# EAGLE design Tacho Update Platine mehrfach (EAGLE 6.4)

## Sheet 1 of 16
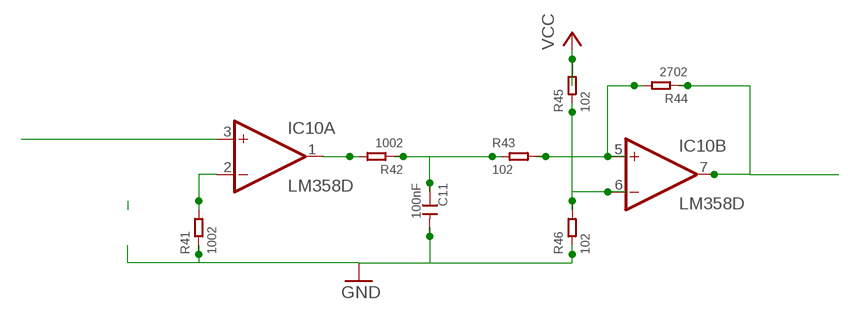
[diagram p0: schematic, sheet 1]

### Parts
C11  100nF  CERAMIC-100NF-50V-10%-X7R(0805)  [C0805]
IC10  LM358D  [SO08]
R41  1002  SMD-RES-10K-1%-1/8W(0805)  [R0805]
R42  1002  SMD-RES-10K-1%-1/8W(0805)  [R0805]
R43  102  SMD-RES-1K-5%-1/8W(0805)  [R0805]
R44  2702  SMD-RES-4.7K-5%-1/8W(0805)  [R0805]
R45  102  SMD-RES-1K-5%-1/8W(0805)  [R0805]
R46  102  SMD-RES-1K-5%-1/8W(0805)  [R0805]

### Nets
GND: C11.2 R41.1 R46.1 ; also sheet 2,3,4,5,6,7,8,9,10,11,12,13,14,15,16
N$24: IC10.3(A:+IN)
N$92: IC10.1(A:OUT) R42.2
N$96: C11.1 R42.1 R43.1
N$97: IC10.5(B:+IN) R43.2 R44.2
N$101: IC10.6(B:-IN) R45.1 R46.2
N$102: IC10.2(A:-IN) R41.2
N$174: IC10.7(B:OUT) R44.1
VCC: R45.2 ; also sheet 2,3,4,5,6,7,8,9,10,11,12,13,14,15,16

## Sheet 2 of 16
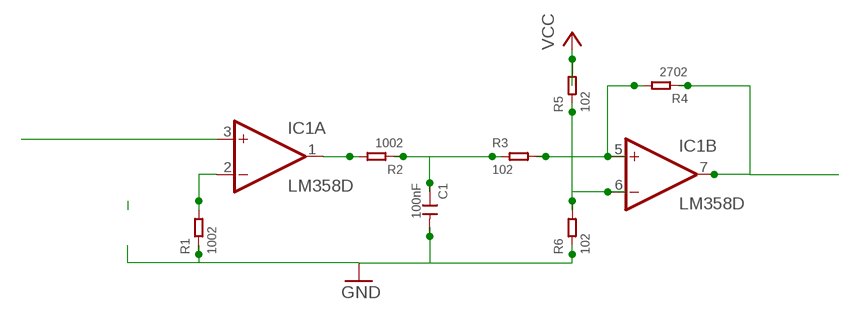
[diagram p1: schematic, sheet 2]

### Parts
C1  100nF  CERAMIC-100NF-50V-10%-X7R(0805)  [C0805]
IC1  LM358D  [SO08]
R1  1002  SMD-RES-10K-1%-1/8W(0805)  [R0805]
R2  1002  SMD-RES-10K-1%-1/8W(0805)  [R0805]
R3  102  SMD-RES-1K-5%-1/8W(0805)  [R0805]
R4  2702  SMD-RES-4.7K-5%-1/8W(0805)  [R0805]
R5  102  SMD-RES-1K-5%-1/8W(0805)  [R0805]
R6  102  SMD-RES-1K-5%-1/8W(0805)  [R0805]

### Nets
GND: C1.2 R1.1 R6.1 ; also sheet 1,3,4,5,6,7,8,9,10,11,12,13,14,15,16
N$7: IC1.3(A:+IN)
N$8: IC1.1(A:OUT) R2.2
N$9: C1.1 R2.1 R3.1
N$11: IC1.5(B:+IN) R3.2 R4.2
N$12: IC1.6(B:-IN) R5.1 R6.2
N$13: IC1.2(A:-IN) R1.2
N$15: IC1.7(B:OUT) R4.1
VCC: R5.2 ; also sheet 1,3,4,5,6,7,8,9,10,11,12,13,14,15,16

## Sheet 3 of 16
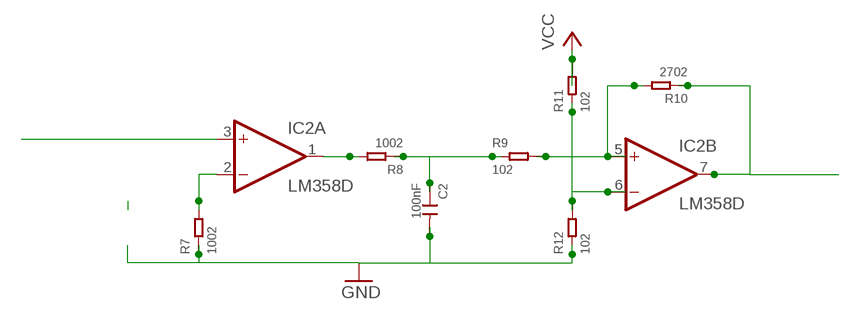
[diagram p2: schematic, sheet 3]

### Parts
C2  100nF  CERAMIC-100NF-50V-10%-X7R(0805)  [C0805]
IC2  LM358D  [SO08]
R7  1002  SMD-RES-10K-1%-1/8W(0805)  [R0805]
R8  1002  SMD-RES-10K-1%-1/8W(0805)  [R0805]
R9  102  SMD-RES-1K-5%-1/8W(0805)  [R0805]
R10  2702  SMD-RES-4.7K-5%-1/8W(0805)  [R0805]
R11  102  SMD-RES-1K-5%-1/8W(0805)  [R0805]
R12  102  SMD-RES-1K-5%-1/8W(0805)  [R0805]

### Nets
GND: C2.2 R7.1 R12.1 ; also sheet 1,2,4,5,6,7,8,9,10,11,12,13,14,15,16
N$30: IC2.3(A:+IN)
N$31: IC2.1(A:OUT) R8.2
N$32: C2.1 R8.1 R9.1
N$33: IC2.5(B:+IN) R9.2 R10.2
N$34: IC2.6(B:-IN) R11.1 R12.2
N$35: IC2.2(A:-IN) R7.2
N$37: IC2.7(B:OUT) R10.1
VCC: R11.2 ; also sheet 1,2,4,5,6,7,8,9,10,11,12,13,14,15,16

## Sheet 4 of 16
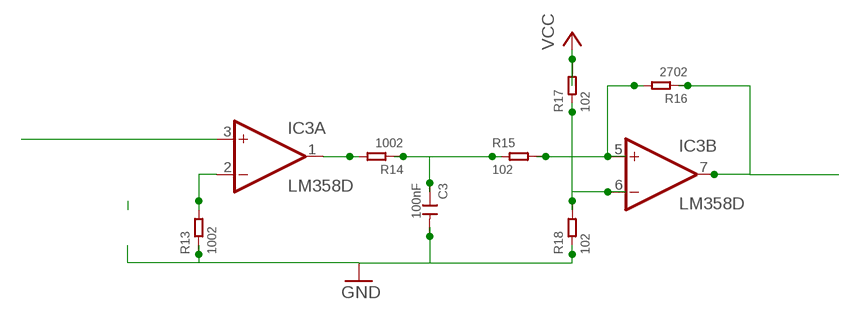
[diagram p3: schematic, sheet 4]

### Parts
C3  100nF  CERAMIC-100NF-50V-10%-X7R(0805)  [C0805]
IC3  LM358D  [SO08]
R13  1002  SMD-RES-10K-1%-1/8W(0805)  [R0805]
R14  1002  SMD-RES-10K-1%-1/8W(0805)  [R0805]
R15  102  SMD-RES-1K-5%-1/8W(0805)  [R0805]
R16  2702  SMD-RES-4.7K-5%-1/8W(0805)  [R0805]
R17  102  SMD-RES-1K-5%-1/8W(0805)  [R0805]
R18  102  SMD-RES-1K-5%-1/8W(0805)  [R0805]

### Nets
GND: C3.2 R13.1 R18.1 ; also sheet 1,2,3,5,6,7,8,9,10,11,12,13,14,15,16
N$38: IC3.3(A:+IN)
N$39: IC3.1(A:OUT) R14.2
N$41: C3.1 R14.1 R15.1
N$42: IC3.5(B:+IN) R15.2 R16.2
N$43: IC3.6(B:-IN) R17.1 R18.2
N$44: IC3.2(A:-IN) R13.2
N$46: IC3.7(B:OUT) R16.1
VCC: R17.2 ; also sheet 1,2,3,5,6,7,8,9,10,11,12,13,14,15,16

## Sheet 5 of 16
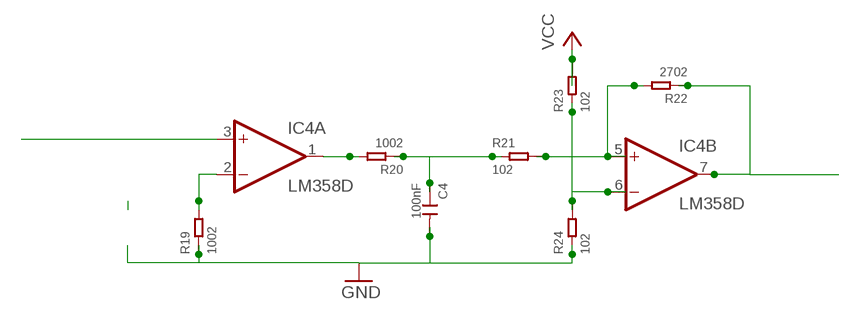
[diagram p4: schematic, sheet 5]

### Parts
C4  100nF  CERAMIC-100NF-50V-10%-X7R(0805)  [C0805]
IC4  LM358D  [SO08]
R19  1002  SMD-RES-10K-1%-1/8W(0805)  [R0805]
R20  1002  SMD-RES-10K-1%-1/8W(0805)  [R0805]
R21  102  SMD-RES-1K-5%-1/8W(0805)  [R0805]
R22  2702  SMD-RES-4.7K-5%-1/8W(0805)  [R0805]
R23  102  SMD-RES-1K-5%-1/8W(0805)  [R0805]
R24  102  SMD-RES-1K-5%-1/8W(0805)  [R0805]

### Nets
GND: C4.2 R19.1 R24.1 ; also sheet 1,2,3,4,6,7,8,9,10,11,12,13,14,15,16
N$78: IC4.3(A:+IN)
N$79: IC4.1(A:OUT) R20.2
N$80: C4.1 R20.1 R21.1
N$81: IC4.5(B:+IN) R21.2 R22.2
N$82: IC4.6(B:-IN) R23.1 R24.2
N$83: IC4.2(A:-IN) R19.2
N$85: IC4.7(B:OUT) R22.1
VCC: R23.2 ; also sheet 1,2,3,4,6,7,8,9,10,11,12,13,14,15,16

## Sheet 6 of 16
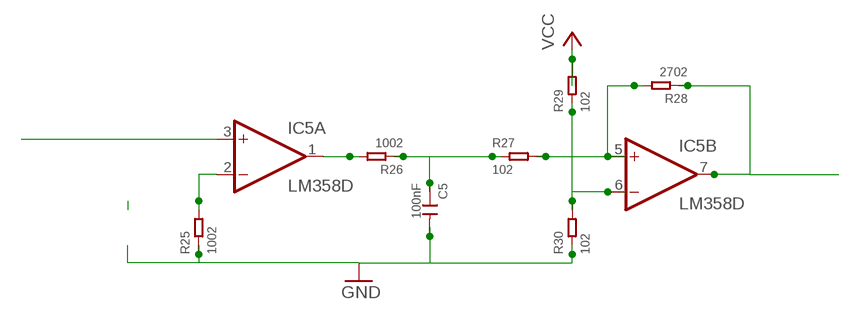
[diagram p5: schematic, sheet 6]

### Parts
C5  100nF  CERAMIC-100NF-50V-10%-X7R(0805)  [C0805]
IC5  LM358D  [SO08]
R25  1002  SMD-RES-10K-1%-1/8W(0805)  [R0805]
R26  1002  SMD-RES-10K-1%-1/8W(0805)  [R0805]
R27  102  SMD-RES-1K-5%-1/8W(0805)  [R0805]
R28  2702  SMD-RES-4.7K-5%-1/8W(0805)  [R0805]
R29  102  SMD-RES-1K-5%-1/8W(0805)  [R0805]
R30  102  SMD-RES-1K-5%-1/8W(0805)  [R0805]

### Nets
GND: C5.2 R25.1 R30.1 ; also sheet 1,2,3,4,5,7,8,9,10,11,12,13,14,15,16
N$86: IC5.3(A:+IN)
N$87: IC5.1(A:OUT) R26.2
N$88: C5.1 R26.1 R27.1
N$89: IC5.5(B:+IN) R27.2 R28.2
N$90: IC5.6(B:-IN) R29.1 R30.2
N$91: IC5.2(A:-IN) R25.2
N$94: IC5.7(B:OUT) R28.1
VCC: R29.2 ; also sheet 1,2,3,4,5,7,8,9,10,11,12,13,14,15,16

## Sheet 7 of 16
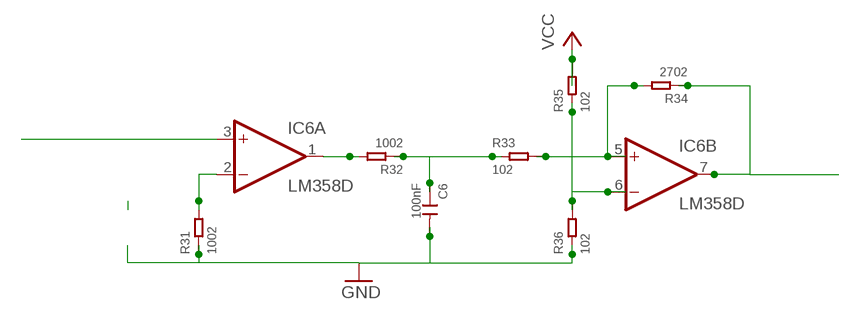
[diagram p6: schematic, sheet 7]

### Parts
C6  100nF  CERAMIC-100NF-50V-10%-X7R(0805)  [C0805]
IC6  LM358D  [SO08]
R31  1002  SMD-RES-10K-1%-1/8W(0805)  [R0805]
R32  1002  SMD-RES-10K-1%-1/8W(0805)  [R0805]
R33  102  SMD-RES-1K-5%-1/8W(0805)  [R0805]
R34  2702  SMD-RES-4.7K-5%-1/8W(0805)  [R0805]
R35  102  SMD-RES-1K-5%-1/8W(0805)  [R0805]
R36  102  SMD-RES-1K-5%-1/8W(0805)  [R0805]

### Nets
GND: C6.2 R31.1 R36.1 ; also sheet 1,2,3,4,5,6,8,9,10,11,12,13,14,15,16
N$95: IC6.3(A:+IN)
N$99: IC6.1(A:OUT) R32.2
N$100: C6.1 R32.1 R33.1
N$103: IC6.5(B:+IN) R33.2 R34.2
N$104: IC6.6(B:-IN) R35.1 R36.2
N$105: IC6.2(A:-IN) R31.2
N$107: IC6.7(B:OUT) R34.1
VCC: R35.2 ; also sheet 1,2,3,4,5,6,8,9,10,11,12,13,14,15,16

## Sheet 8 of 16
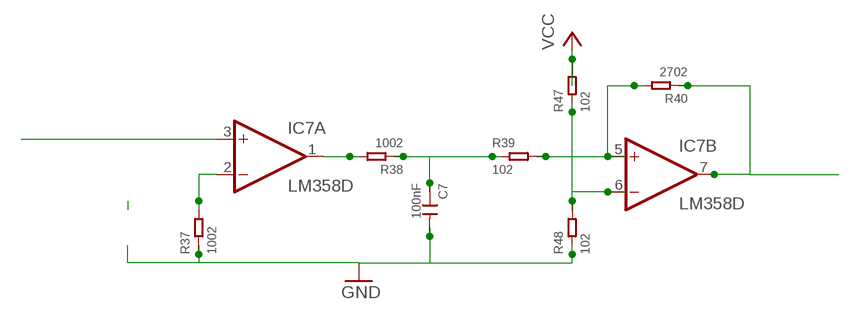
[diagram p7: schematic, sheet 8]

### Parts
C7  100nF  CERAMIC-100NF-50V-10%-X7R(0805)  [C0805]
IC7  LM358D  [SO08]
R37  1002  SMD-RES-10K-1%-1/8W(0805)  [R0805]
R38  1002  SMD-RES-10K-1%-1/8W(0805)  [R0805]
R39  102  SMD-RES-1K-5%-1/8W(0805)  [R0805]
R40  2702  SMD-RES-4.7K-5%-1/8W(0805)  [R0805]
R47  102  SMD-RES-1K-5%-1/8W(0805)  [R0805]
R48  102  SMD-RES-1K-5%-1/8W(0805)  [R0805]

### Nets
GND: C7.2 R37.1 R48.1 ; also sheet 1,2,3,4,5,6,7,9,10,11,12,13,14,15,16
N$108: IC7.3(A:+IN)
N$109: IC7.1(A:OUT) R38.2
N$110: C7.1 R38.1 R39.1
N$111: IC7.5(B:+IN) R39.2 R40.2
N$112: IC7.6(B:-IN) R47.1 R48.2
N$113: IC7.2(A:-IN) R37.2
N$115: IC7.7(B:OUT) R40.1
VCC: R47.2 ; also sheet 1,2,3,4,5,6,7,9,10,11,12,13,14,15,16

## Sheet 9 of 16
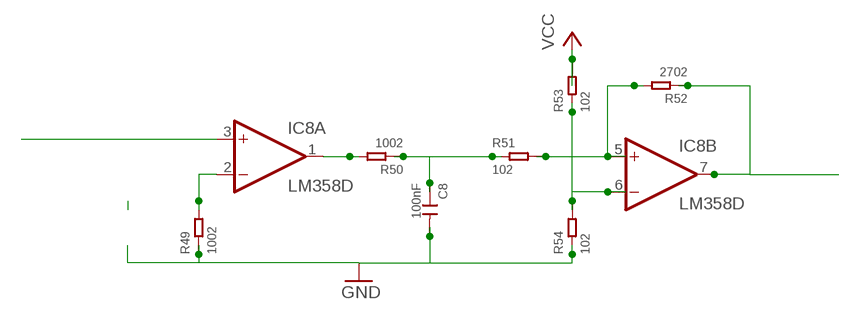
[diagram p8: schematic, sheet 9]

### Parts
C8  100nF  CERAMIC-100NF-50V-10%-X7R(0805)  [C0805]
IC8  LM358D  [SO08]
R49  1002  SMD-RES-10K-1%-1/8W(0805)  [R0805]
R50  1002  SMD-RES-10K-1%-1/8W(0805)  [R0805]
R51  102  SMD-RES-1K-5%-1/8W(0805)  [R0805]
R52  2702  SMD-RES-4.7K-5%-1/8W(0805)  [R0805]
R53  102  SMD-RES-1K-5%-1/8W(0805)  [R0805]
R54  102  SMD-RES-1K-5%-1/8W(0805)  [R0805]

### Nets
GND: C8.2 R49.1 R54.1 ; also sheet 1,2,3,4,5,6,7,8,10,11,12,13,14,15,16
N$168: IC8.3(A:+IN)
N$169: IC8.1(A:OUT) R50.2
N$170: C8.1 R50.1 R51.1
N$171: IC8.5(B:+IN) R51.2 R52.2
N$172: IC8.6(B:-IN) R53.1 R54.2
N$173: IC8.2(A:-IN) R49.2
N$176: IC8.7(B:OUT) R52.1
VCC: R53.2 ; also sheet 1,2,3,4,5,6,7,8,10,11,12,13,14,15,16

## Sheet 10 of 16
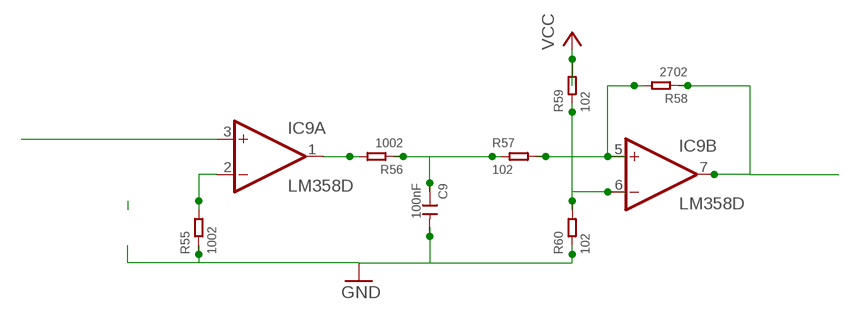
[diagram p9: schematic, sheet 10]

### Parts
C9  100nF  CERAMIC-100NF-50V-10%-X7R(0805)  [C0805]
IC9  LM358D  [SO08]
R55  1002  SMD-RES-10K-1%-1/8W(0805)  [R0805]
R56  1002  SMD-RES-10K-1%-1/8W(0805)  [R0805]
R57  102  SMD-RES-1K-5%-1/8W(0805)  [R0805]
R58  2702  SMD-RES-4.7K-5%-1/8W(0805)  [R0805]
R59  102  SMD-RES-1K-5%-1/8W(0805)  [R0805]
R60  102  SMD-RES-1K-5%-1/8W(0805)  [R0805]

### Nets
GND: C9.2 R55.1 R60.1 ; also sheet 1,2,3,4,5,6,7,8,9,11,12,13,14,15,16
N$177: IC9.3(A:+IN)
N$178: IC9.1(A:OUT) R56.2
N$179: C9.1 R56.1 R57.1
N$180: IC9.5(B:+IN) R57.2 R58.2
N$181: IC9.6(B:-IN) R59.1 R60.2
N$182: IC9.2(A:-IN) R55.2
N$184: IC9.7(B:OUT) R58.1
VCC: R59.2 ; also sheet 1,2,3,4,5,6,7,8,9,11,12,13,14,15,16

## Sheet 11 of 16
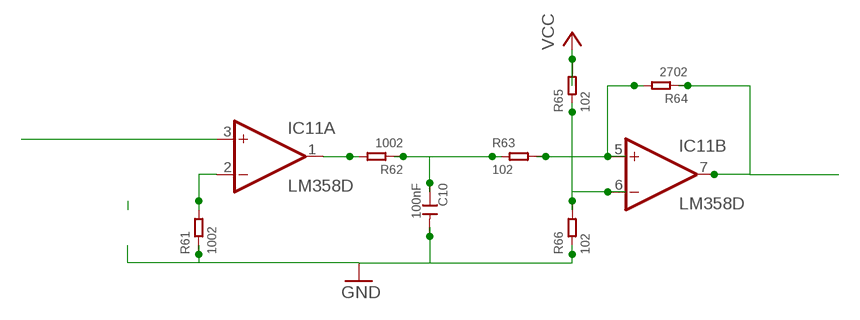
[diagram p10: schematic, sheet 11]

### Parts
C10  100nF  CERAMIC-100NF-50V-10%-X7R(0805)  [C0805]
IC11  LM358D  [SO08]
R61  1002  SMD-RES-10K-1%-1/8W(0805)  [R0805]
R62  1002  SMD-RES-10K-1%-1/8W(0805)  [R0805]
R63  102  SMD-RES-1K-5%-1/8W(0805)  [R0805]
R64  2702  SMD-RES-4.7K-5%-1/8W(0805)  [R0805]
R65  102  SMD-RES-1K-5%-1/8W(0805)  [R0805]
R66  102  SMD-RES-1K-5%-1/8W(0805)  [R0805]

### Nets
GND: C10.2 R61.1 R66.1 ; also sheet 1,2,3,4,5,6,7,8,9,10,12,13,14,15,16
N$185: IC11.3(A:+IN)
N$186: IC11.1(A:OUT) R62.2
N$187: C10.1 R62.1 R63.1
N$188: IC11.5(B:+IN) R63.2 R64.2
N$189: IC11.6(B:-IN) R65.1 R66.2
N$190: IC11.2(A:-IN) R61.2
N$192: IC11.7(B:OUT) R64.1
VCC: R65.2 ; also sheet 1,2,3,4,5,6,7,8,9,10,12,13,14,15,16

## Sheet 12 of 16
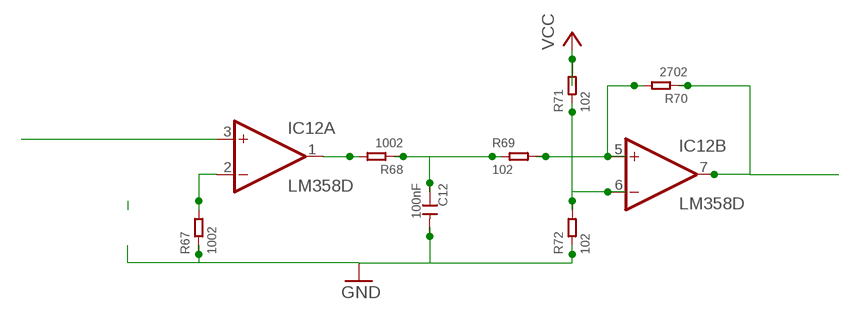
[diagram p11: schematic, sheet 12]

### Parts
C12  100nF  CERAMIC-100NF-50V-10%-X7R(0805)  [C0805]
IC12  LM358D  [SO08]
R67  1002  SMD-RES-10K-1%-1/8W(0805)  [R0805]
R68  1002  SMD-RES-10K-1%-1/8W(0805)  [R0805]
R69  102  SMD-RES-1K-5%-1/8W(0805)  [R0805]
R70  2702  SMD-RES-4.7K-5%-1/8W(0805)  [R0805]
R71  102  SMD-RES-1K-5%-1/8W(0805)  [R0805]
R72  102  SMD-RES-1K-5%-1/8W(0805)  [R0805]

### Nets
GND: C12.2 R67.1 R72.1 ; also sheet 1,2,3,4,5,6,7,8,9,10,11,13,14,15,16
N$193: IC12.3(A:+IN)
N$194: IC12.1(A:OUT) R68.2
N$195: C12.1 R68.1 R69.1
N$196: IC12.5(B:+IN) R69.2 R70.2
N$197: IC12.6(B:-IN) R71.1 R72.2
N$198: IC12.2(A:-IN) R67.2
N$200: IC12.7(B:OUT) R70.1
VCC: R71.2 ; also sheet 1,2,3,4,5,6,7,8,9,10,11,13,14,15,16

## Sheet 13 of 16
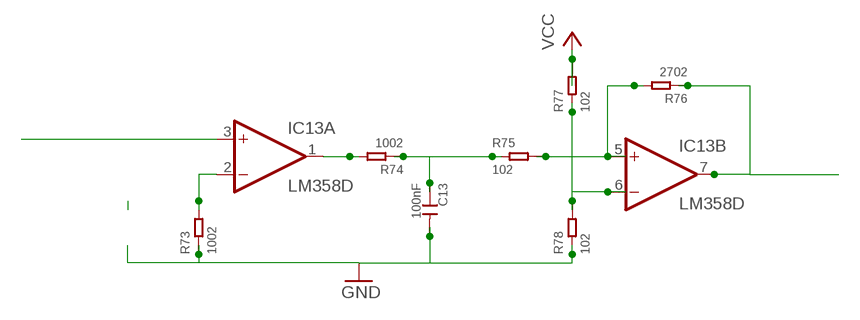
[diagram p12: schematic, sheet 13]

### Parts
C13  100nF  CERAMIC-100NF-50V-10%-X7R(0805)  [C0805]
IC13  LM358D  [SO08]
R73  1002  SMD-RES-10K-1%-1/8W(0805)  [R0805]
R74  1002  SMD-RES-10K-1%-1/8W(0805)  [R0805]
R75  102  SMD-RES-1K-5%-1/8W(0805)  [R0805]
R76  2702  SMD-RES-4.7K-5%-1/8W(0805)  [R0805]
R77  102  SMD-RES-1K-5%-1/8W(0805)  [R0805]
R78  102  SMD-RES-1K-5%-1/8W(0805)  [R0805]

### Nets
GND: C13.2 R73.1 R78.1 ; also sheet 1,2,3,4,5,6,7,8,9,10,11,12,14,15,16
N$201: IC13.3(A:+IN)
N$202: IC13.1(A:OUT) R74.2
N$203: C13.1 R74.1 R75.1
N$204: IC13.5(B:+IN) R75.2 R76.2
N$205: IC13.6(B:-IN) R77.1 R78.2
N$206: IC13.2(A:-IN) R73.2
N$208: IC13.7(B:OUT) R76.1
VCC: R77.2 ; also sheet 1,2,3,4,5,6,7,8,9,10,11,12,14,15,16

## Sheet 14 of 16
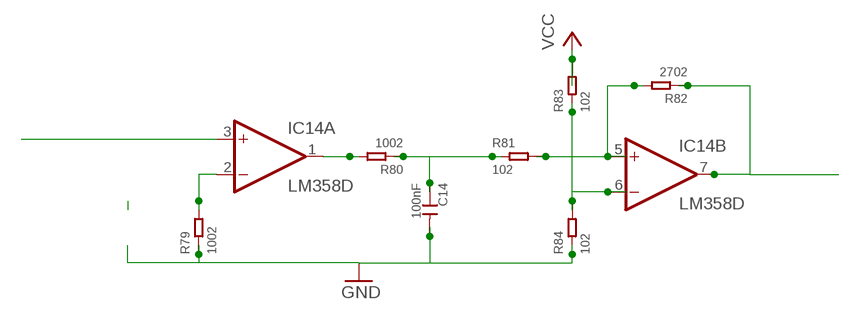
[diagram p13: schematic, sheet 14]

### Parts
C14  100nF  CERAMIC-100NF-50V-10%-X7R(0805)  [C0805]
IC14  LM358D  [SO08]
R79  1002  SMD-RES-10K-1%-1/8W(0805)  [R0805]
R80  1002  SMD-RES-10K-1%-1/8W(0805)  [R0805]
R81  102  SMD-RES-1K-5%-1/8W(0805)  [R0805]
R82  2702  SMD-RES-4.7K-5%-1/8W(0805)  [R0805]
R83  102  SMD-RES-1K-5%-1/8W(0805)  [R0805]
R84  102  SMD-RES-1K-5%-1/8W(0805)  [R0805]

### Nets
GND: C14.2 R79.1 R84.1 ; also sheet 1,2,3,4,5,6,7,8,9,10,11,12,13,15,16
N$209: IC14.3(A:+IN)
N$210: IC14.1(A:OUT) R80.2
N$211: C14.1 R80.1 R81.1
N$212: IC14.5(B:+IN) R81.2 R82.2
N$213: IC14.6(B:-IN) R83.1 R84.2
N$214: IC14.2(A:-IN) R79.2
N$216: IC14.7(B:OUT) R82.1
VCC: R83.2 ; also sheet 1,2,3,4,5,6,7,8,9,10,11,12,13,15,16

## Sheet 15 of 16
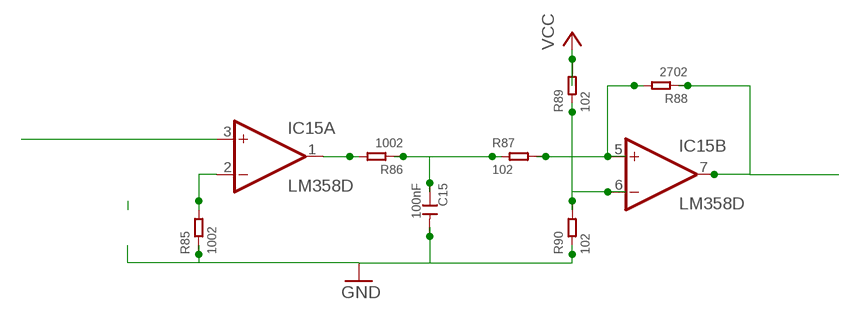
[diagram p14: schematic, sheet 15]

### Parts
C15  100nF  CERAMIC-100NF-50V-10%-X7R(0805)  [C0805]
IC15  LM358D  [SO08]
R85  1002  SMD-RES-10K-1%-1/8W(0805)  [R0805]
R86  1002  SMD-RES-10K-1%-1/8W(0805)  [R0805]
R87  102  SMD-RES-1K-5%-1/8W(0805)  [R0805]
R88  2702  SMD-RES-4.7K-5%-1/8W(0805)  [R0805]
R89  102  SMD-RES-1K-5%-1/8W(0805)  [R0805]
R90  102  SMD-RES-1K-5%-1/8W(0805)  [R0805]

### Nets
GND: C15.2 R85.1 R90.1 ; also sheet 1,2,3,4,5,6,7,8,9,10,11,12,13,14,16
N$217: IC15.3(A:+IN)
N$218: IC15.1(A:OUT) R86.2
N$219: C15.1 R86.1 R87.1
N$220: IC15.5(B:+IN) R87.2 R88.2
N$221: IC15.6(B:-IN) R89.1 R90.2
N$222: IC15.2(A:-IN) R85.2
N$224: IC15.7(B:OUT) R88.1
VCC: R89.2 ; also sheet 1,2,3,4,5,6,7,8,9,10,11,12,13,14,16

## Sheet 16 of 16
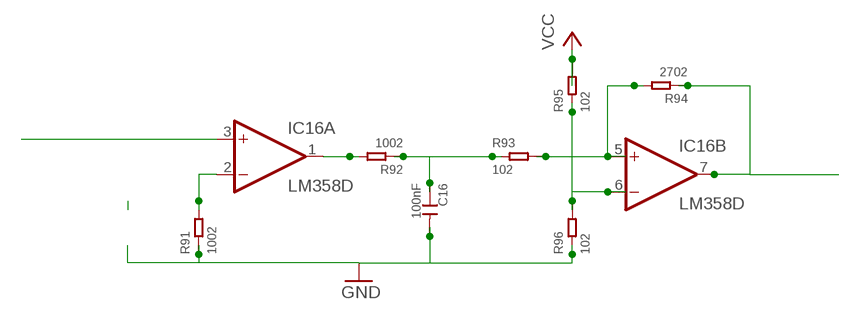
[diagram p15: schematic, sheet 16]

### Parts
C16  100nF  CERAMIC-100NF-50V-10%-X7R(0805)  [C0805]
IC16  LM358D  [SO08]
R91  1002  SMD-RES-10K-1%-1/8W(0805)  [R0805]
R92  1002  SMD-RES-10K-1%-1/8W(0805)  [R0805]
R93  102  SMD-RES-1K-5%-1/8W(0805)  [R0805]
R94  2702  SMD-RES-4.7K-5%-1/8W(0805)  [R0805]
R95  102  SMD-RES-1K-5%-1/8W(0805)  [R0805]
R96  102  SMD-RES-1K-5%-1/8W(0805)  [R0805]

### Nets
GND: C16.2 R91.1 R96.1 ; also sheet 1,2,3,4,5,6,7,8,9,10,11,12,13,14,15
N$225: IC16.3(A:+IN)
N$226: IC16.1(A:OUT) R92.2
N$227: C16.1 R92.1 R93.1
N$228: IC16.5(B:+IN) R93.2 R94.2
N$229: IC16.6(B:-IN) R95.1 R96.2
N$230: IC16.2(A:-IN) R91.2
N$232: IC16.7(B:OUT) R94.1
VCC: R95.2 ; also sheet 1,2,3,4,5,6,7,8,9,10,11,12,13,14,15

## Power pins joined to a net without a drawn wire
V+: IC10.8(P:V+)
V+1: IC1.8(P:V+)
V+2: IC2.8(P:V+)
V+3: IC3.8(P:V+)
V+4: IC4.8(P:V+)
V+5: IC5.8(P:V+)
V+6: IC6.8(P:V+)
V+7: IC7.8(P:V+)
V+8: IC8.8(P:V+)
V+9: IC9.8(P:V+)
V+10: IC11.8(P:V+)
V+11: IC12.8(P:V+)
V+12: IC13.8(P:V+)
V+13: IC14.8(P:V+)
V+14: IC15.8(P:V+)
V+15: IC16.8(P:V+)
V-: IC10.4(P:V-)
V-1: IC1.4(P:V-)
V-2: IC2.4(P:V-)
V-3: IC3.4(P:V-)
V-4: IC4.4(P:V-)
V-5: IC5.4(P:V-)
V-6: IC6.4(P:V-)
V-7: IC7.4(P:V-)
V-8: IC8.4(P:V-)
V-9: IC9.4(P:V-)
V-10: IC11.4(P:V-)
V-11: IC12.4(P:V-)
V-12: IC13.4(P:V-)
V-13: IC14.4(P:V-)
V-14: IC15.4(P:V-)
V-15: IC16.4(P:V-)

## Library data of the parts
C1-C16 = Seeed-Capacitor-2016:CERAMIC-100NF-50V-10%-X7R(0805): 302010165; MPN: CC0805KRX7R9BB104; VALUE: 100nf
IC1-IC16 = linear_BMW:LM358: OP AMP also LM158; LM258; LM2904 Source: http://cache.national.com/ds/LM/LM158.pdf
R1 R2 R7 R8 R13 R14 R19 R20 R25 R26 R31 R32 R37 R38 R41 R42 R49 R50 R55 R56 R61 R62 R67 R68 R73 R74 R79 R80 R85 R86 R91 R92 = Seeed-Resistor-2016:SMD-RES-10K-1%-1/8W(0805): 301010361; MPN: RC0805FR-0710KL; VALUE: 10K
R3 R5 R6 R9 R11 R12 R15 R17 R18 R21 R23 R24 R27 R29 R30 R33 R35 R36 R39 R43 R45-R48 R51 R53 R54 R57 R59 R60 R63 R65 R66 R69 R71 R72 R75 R77 R78 R81 R83 R84 R87 R89 R90 R93 R95 R96 = Seeed-Resistor-2016:SMD-RES-1K-5%-1/8W(0805): 301010311; MPN: RC0805JR-071KL; VALUE: 1K
R4 R10 R16 R22 R28 R34 R40 R44 R52 R58 R64 R70 R76 R82 R88 R94 = Seeed-Resistor-2016:SMD-RES-4.7K-5%-1/8W(0805): 301010306; MPN: RC0805JR-074K7L; VALUE: 4.7K

## Board
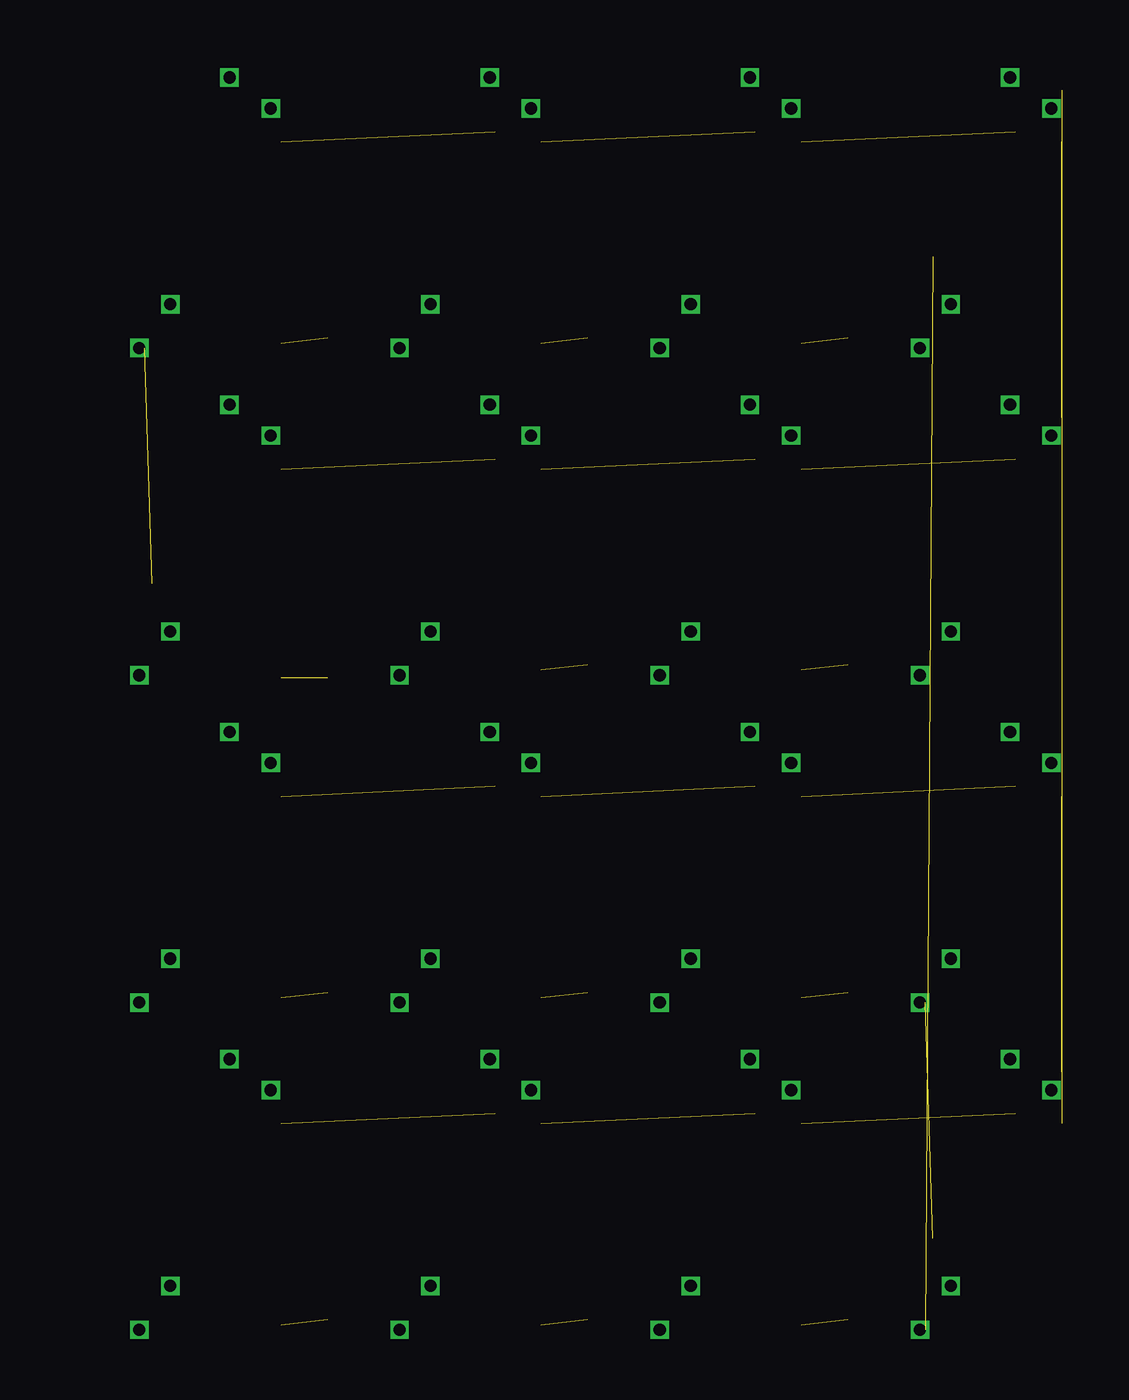
[diagram p16: board, top side]
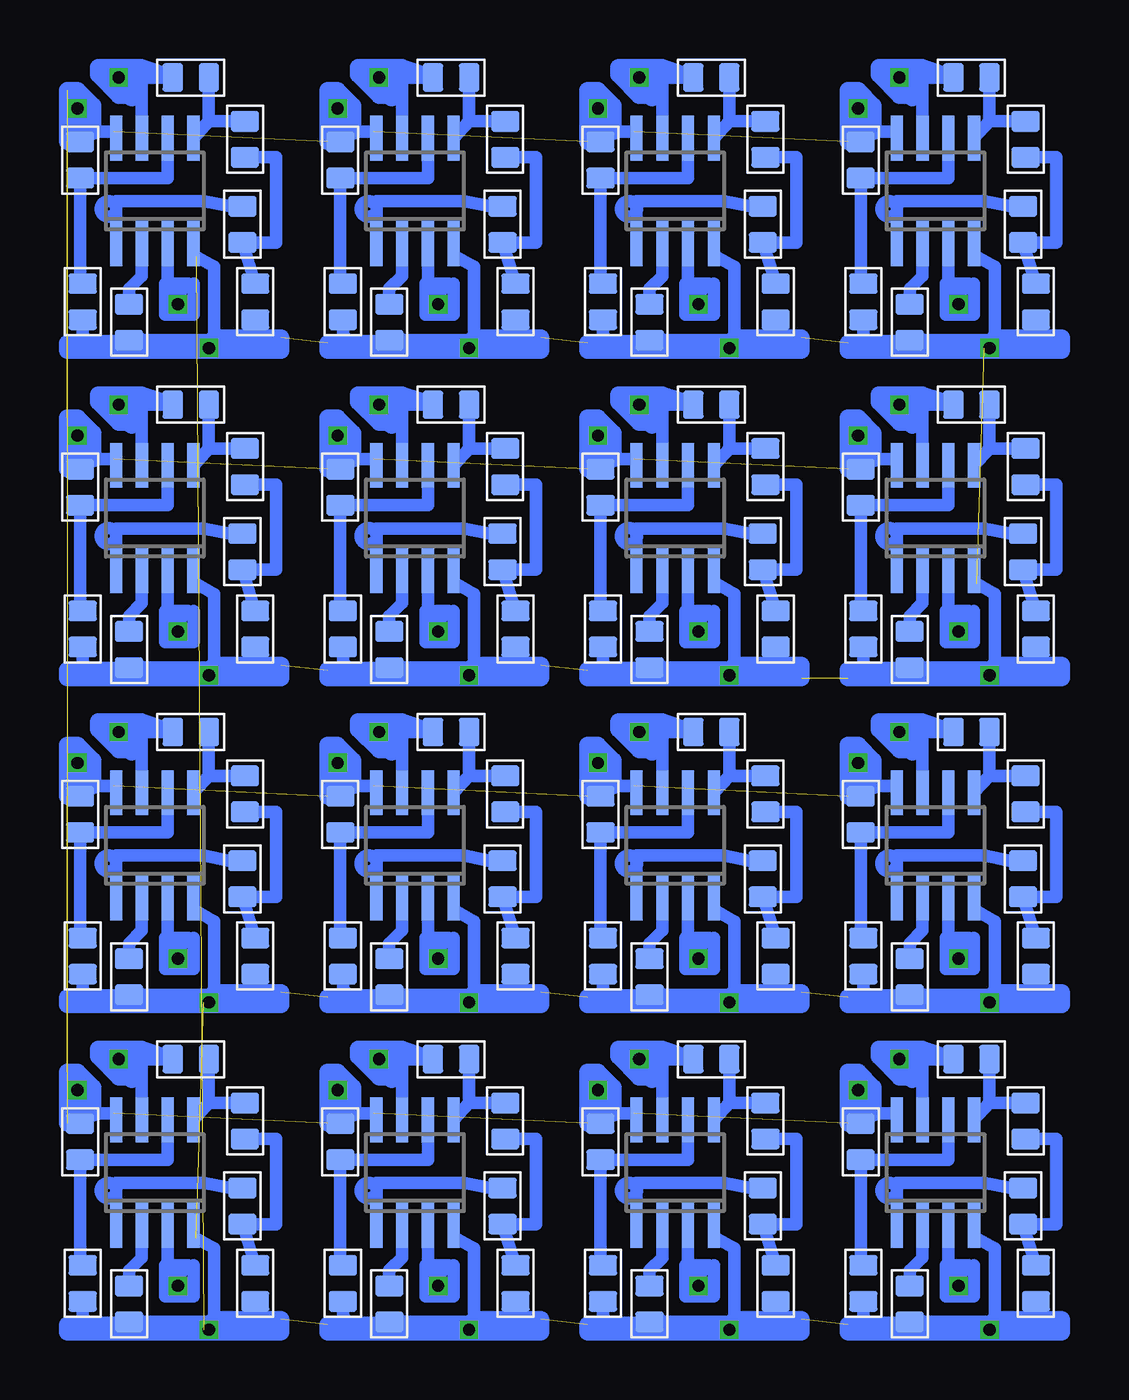
[diagram p17: board, bottom side, seen from below]

No outline drawn. Coordinates in mm, seen from the top.
Copper layers (1*16): Top 0.035mm / dielectric 1.5mm / Bottom 0.035mm
Design rules "multi-cb_035um-cu": minimum track width 6mil, minimum drill 12mil, track to track 6mil, track to pad 6mil, pad to pad 6mil, via to via 6mil, smd to smd 6mil, copper to edge 20mil, drill to drill 8mil, minimum pad ring 8mil, minimum via ring 6mil, stop-mask expansion 3mil, vias tented up to drill 0mil, thermal gap 8mil

### Footprints (pad centres in the part's own frame; a part is rotated, then mirrored left to right if it is on the bottom)
C0805 = smd 1.397 x 1.016: 1 0,0.889; 2 0,-0.889
SO08 = smd 0.6 x 2.2: 1 -1.905,-2.6; 2 -0.635,-2.6; 3 0.635,-2.6; 4 1.905,-2.6; 5 1.905,2.6; 6 0.635,2.6; 7 -0.635,2.6; 8 -1.905,2.6
R0805 = smd 1.397 x 1.016: 1 0,0.889; 2 0,-0.889

### Placement (x,y rotation side)
C1  15.49,3.56 0 bottom
C2  28.32,3.56 0 bottom
C3  41.15,3.56 0 bottom
C4  2.67,19.68 0 bottom
C5  15.49,19.68 0 bottom
C6  28.32,19.68 0 bottom
C7  41.15,19.68 0 bottom
C8  2.67,35.81 0 bottom
C9  15.49,35.81 0 bottom
C10  28.32,35.81 0 bottom
C11  2.67,3.56 0 bottom
C12  41.15,35.81 0 bottom
C13  2.67,51.94 0 bottom
C14  15.49,51.94 0 bottom
C15  28.32,51.94 0 bottom
C16  41.15,51.94 0 bottom
IC1  20.45,9.02 0 bottom
IC2  33.27,9.02 0 bottom
IC3  46.1,9.02 0 bottom
IC4  7.62,25.15 0 bottom
IC5  20.45,25.15 0 bottom
IC6  33.27,25.15 0 bottom
IC7  46.1,25.15 0 bottom
IC8  7.62,41.27 0 bottom
IC9  20.45,41.27 0 bottom
IC10  7.62,9.02 0 bottom
IC11  33.27,41.27 0 bottom
IC12  46.1,41.27 0 bottom
IC13  7.62,57.4 0 bottom
IC14  20.45,57.4 0 bottom
IC15  33.27,57.4 0 bottom
IC16  46.1,57.4 0 bottom
R1  21.72,2.54 180 bottom
R2  16.13,7.37 180 bottom
R3  16,11.56 180 bottom
R4  18.67,14.61 90 bottom
R5  24.13,10.54 180 bottom
R6  24,3.56 180 bottom
R7  34.54,2.54 180 bottom
R8  28.96,7.37 180 bottom
R9  28.83,11.56 180 bottom
R10  31.5,14.61 90 bottom
R11  36.96,10.54 180 bottom
R12  36.83,3.56 180 bottom
R13  47.37,2.54 180 bottom
R14  41.78,7.37 180 bottom
R15  41.66,11.56 180 bottom
R16  44.32,14.61 90 bottom
R17  49.78,10.54 180 bottom
R18  49.66,3.56 180 bottom
R19  8.89,18.67 180 bottom
R20  3.3,23.5 180 bottom
R21  3.17,27.69 180 bottom
R22  5.84,30.73 90 bottom
R23  11.3,26.67 180 bottom
R24  11.18,19.68 180 bottom
R25  21.72,18.67 180 bottom
R26  16.13,23.5 180 bottom
R27  16,27.69 180 bottom
R28  18.67,30.73 90 bottom
R29  24.13,26.67 180 bottom
R30  24,19.68 180 bottom
R31  34.54,18.67 180 bottom
R32  28.96,23.5 180 bottom
R33  28.83,27.69 180 bottom
R34  31.5,30.73 90 bottom
R35  36.96,26.67 180 bottom
R36  36.83,19.68 180 bottom
R37  47.37,18.67 180 bottom
R38  41.78,23.5 180 bottom
R39  41.66,27.69 180 bottom
R40  44.32,30.73 90 bottom
R41  8.89,2.54 180 bottom
R42  3.3,7.37 180 bottom
R43  3.17,11.56 180 bottom
R44  5.84,14.61 90 bottom
R45  11.3,10.54 180 bottom
R46  11.18,3.56 180 bottom
R47  49.78,26.67 180 bottom
R48  49.66,19.68 180 bottom
R49  8.89,34.8 180 bottom
R50  3.3,39.62 180 bottom
R51  3.17,43.81 180 bottom
R52  5.84,46.86 90 bottom
R53  11.3,42.8 180 bottom
R54  11.18,35.81 180 bottom
R55  21.72,34.8 180 bottom
R56  16.13,39.62 180 bottom
R57  16,43.81 180 bottom
R58  18.67,46.86 90 bottom
R59  24.13,42.8 180 bottom
R60  24,35.81 180 bottom
R61  34.54,34.8 180 bottom
R62  28.96,39.62 180 bottom
R63  28.83,43.81 180 bottom
R64  31.5,46.86 90 bottom
R65  36.96,42.8 180 bottom
R66  36.83,35.81 180 bottom
R67  47.37,34.8 180 bottom
R68  41.78,39.62 180 bottom
R69  41.66,43.81 180 bottom
R70  44.32,46.86 90 bottom
R71  49.78,42.8 180 bottom
R72  49.66,35.81 180 bottom
R73  8.89,50.93 180 bottom
R74  3.3,55.75 180 bottom
R75  3.17,59.94 180 bottom
R76  5.84,62.99 90 bottom
R77  11.3,58.93 180 bottom
R78  11.18,51.94 180 bottom
R79  21.72,50.93 180 bottom
R80  16.13,55.75 180 bottom
R81  16,59.94 180 bottom
R82  18.67,62.99 90 bottom
R83  24.13,58.93 180 bottom
R84  24,51.94 180 bottom
R85  34.54,50.93 180 bottom
R86  28.96,55.75 180 bottom
R87  28.83,59.94 180 bottom
R88  31.5,62.99 90 bottom
R89  36.96,58.93 180 bottom
R90  36.83,51.94 180 bottom
R91  47.37,50.93 180 bottom
R92  41.78,55.75 180 bottom
R93  41.66,59.94 180 bottom
R94  44.32,62.99 90 bottom
R95  49.78,58.93 180 bottom
R96  49.66,51.94 180 bottom

### Tracks (layer width: path | path; a pad name or v marks a point on that pad's centre or on a via)
GND  (15 unrouted)
  Bottom 0.61: R46.1 11.18,1.91 10.54,1.27 5.21,1.27 4.7,1.78 4.7,5.27 5.59,5.78 | R41.1 8.38,1.65 2.67,1.65 C11.2 | R6.1 24,1.91 23.37,1.27 18.03,1.27 17.53,1.78 17.53,5.27 18.41,5.78 | R1.1 21.21,1.65 15.49,1.65 C1.2 | R12.1 36.83,1.91 36.2,1.27 30.86,1.27 30.35,1.78 30.35,5.27 31.24,5.78 | R7.1 34.04,1.65 28.32,1.65 C2.2 | R18.1 49.66,1.91 49.02,1.27 43.69,1.27 43.18,1.78 43.18,5.27 44.07,5.78 | R13.1 46.86,1.65 41.15,1.65 C3.2 | R24.1 11.18,18.03 10.54,17.4 5.21,17.4 4.7,17.91 4.7,21.4 5.59,21.91 | R19.1 8.38,17.78 2.67,17.78 C4.2 | R30.1 24,18.03 23.37,17.4 18.03,17.4 17.53,17.91 17.53,21.4 18.41,21.91 | R25.1 21.21,17.78 15.49,17.78 C5.2 | R36.1 36.83,18.03 36.2,17.4 30.86,17.4 30.35,17.91 30.35,21.4 31.24,21.91 | R31.1 34.04,17.78 28.32,17.78 C6.2 | R48.1 49.66,18.03 49.02,17.4 43.69,17.4 43.18,17.91 43.18,21.4 44.07,21.91 | R37.1 46.86,17.78 41.15,17.78 C7.2 | R54.1 11.18,34.16 10.54,33.53 5.21,33.53 4.7,34.04 4.7,37.53 5.59,38.04 | R49.1 8.38,33.91 2.67,33.91 C8.2 | R60.1 24,34.16 23.37,33.53 18.03,33.53 17.53,34.04 17.53,37.53 18.41,38.04 | R55.1 21.21,33.91 15.49,33.91 C9.2 | R66.1 36.83,34.16 36.2,33.53 30.86,33.53 30.35,34.04 30.35,37.53 31.24,38.04 | R61.1 34.04,33.91 28.32,33.91 C10.2 | R72.1 49.66,34.16 49.02,33.53 43.69,33.53 43.18,34.04 43.18,37.53 44.07,38.04 | R67.1 46.86,33.91 41.15,33.91 C12.2 | R78.1 11.18,50.29 10.54,49.66 5.21,49.66 4.7,50.16 4.7,53.66 5.59,54.17 | R73.1 8.38,50.04 2.67,50.04 C13.2 | R84.1 24,50.29 23.37,49.66 18.03,49.66 17.53,50.16 17.53,53.66 18.41,54.17 | R79.1 21.21,50.04 15.49,50.04 C14.2 | R90.1 36.83,50.29 36.2,49.66 30.86,49.66 30.35,50.16 30.35,53.66 31.24,54.17
  Bottom 0.61: R85.1 34.04,50.04 28.32,50.04 C15.2 | R96.1 49.66,50.29 49.02,49.66 43.69,49.66 43.18,50.16 43.18,53.66 44.07,54.17 | R91.1 46.86,50.04 41.15,50.04 C16.2
  Bottom 0.813: 4.7,1.78 1.4,1.78 1.4,1.14 11.94,1.14 11.94,1.52 8.51,1.52 8.38,1.65 | 17.53,1.78 14.22,1.78 14.22,1.14 24.77,1.14 24.77,1.52 21.34,1.52 21.21,1.65 | 30.35,1.78 27.05,1.78 27.05,1.14 37.59,1.14 37.59,1.52 34.16,1.52 34.04,1.65 | 43.18,1.78 39.88,1.78 39.88,1.14 50.42,1.14 50.42,1.52 46.99,1.52 46.86,1.65 | 4.7,17.91 1.4,17.91 1.4,17.27 11.94,17.27 11.94,17.65 8.51,17.65 8.38,17.78 | 17.53,17.91 14.22,17.91 14.22,17.27 24.77,17.27 24.77,17.65 21.34,17.65 21.21,17.78 | 30.35,17.91 27.05,17.91 27.05,17.27 37.59,17.27 37.59,17.65 34.16,17.65 34.04,17.78 | 43.18,17.91 39.88,17.91 39.88,17.27 50.42,17.27 50.42,17.65 46.99,17.65 46.86,17.78 | 4.7,34.04 1.4,34.04 1.4,33.4 11.94,33.4 11.94,33.78 8.51,33.78 8.38,33.91 | 17.53,34.04 14.22,34.04 14.22,33.4 24.77,33.4 24.77,33.78 21.34,33.78 21.21,33.91 | 30.35,34.04 27.05,34.04 27.05,33.4 37.59,33.4 37.59,33.78 34.16,33.78 34.04,33.91 | 43.18,34.04 39.88,34.04 39.88,33.4 50.42,33.4 50.42,33.78 46.99,33.78 46.86,33.91 | 4.7,50.16 1.4,50.16 1.4,49.53 11.94,49.53 11.94,49.91 8.51,49.91 8.38,50.04 | 17.53,50.16 14.22,50.16 14.22,49.53 24.77,49.53 24.77,49.91 21.34,49.91 21.21,50.04 | 30.35,50.16 27.05,50.16 27.05,49.53 37.59,49.53 37.59,49.91 34.16,49.91 34.04,50.04 | 43.18,50.16 39.88,50.16 39.88,49.53 50.42,49.53 50.42,49.91 46.99,49.91 46.86,50.04
N$1  (via drill 0.6)
  other vias: 11.43,13.08
N$2  (via drill 0.6)
  other vias: 9.4,14.61
N$3  (via drill 0.6)
  other vias: 6.48,3.43
N$4  (via drill 0.6)
  other vias: 4.95,1.27
N$5
  Bottom 0.61: 5.71,4.45 5.71,2.92 7.11,2.92 7.11,4.45
N$6
  Bottom 0.813: 6.35,4.19 6.48,4.19 6.48,3.17
N$7
  Bottom 0.61: IC1.3 19.81,4.45 18.8,4.45
N$8
  Bottom 0.61: IC1.1 22.35,8.51 18.03,8.51 16.76,8.26 R2.2
N$9
  Bottom 0.61: R3.1 14.48,10.67 14.48,6.48 R2.1 C1.1
N$11
  Bottom 0.61: R4.2 17.78,12.45 | 17.78,12.45 IC1.5 | R3.2 17.78,12.45
N$12
  Bottom 0.61: IC1.6 19.81,9.65 R5.1 24.13,4.57 R6.2
N$13
  Bottom 0.61: IC1.2 21.08,4.83 21.72,4.19 R1.2
N$15
  Bottom 0.61: R4.1 20.95,14.61 21.08,14.48 IC1.7
  Bottom 0.813: R4.1 21.08,15.11 23.24,15.11 23.24,14.73 22.23,13.72 21.72,13.72 21.59,13.59 21.59,14.48 22.35,14.48
N$23  (via drill 0.6)
  other vias: 24.26,13.08
N$24
  Bottom 0.61: IC10.3 6.99,4.45 5.97,4.45
N$25  (via drill 0.6)
  other vias: 22.23,14.61
N$26  (via drill 0.6)
  other vias: 19.3,3.43
N$27  (via drill 0.6)
  other vias: 17.78,1.27
N$28
  Bottom 0.61: 18.54,4.45 18.54,2.92 19.94,2.92 19.94,4.45
N$29
  Bottom 0.813: 19.18,4.19 19.3,4.19 19.3,3.17
N$30
  Bottom 0.61: IC2.3 32.64,4.45 31.62,4.45
N$31
  Bottom 0.61: IC2.1 35.18,8.51 30.86,8.51 29.59,8.26 R8.2
N$32
  Bottom 0.61: R9.1 27.3,10.67 27.3,6.48 R8.1 C2.1
N$33
  Bottom 0.61: R10.2 30.61,12.45 | 30.61,12.45 IC2.5 | R9.2 30.61,12.45
N$34
  Bottom 0.61: IC2.6 32.64,9.65 R11.1 36.96,4.57 R12.2
N$35
  Bottom 0.61: IC2.2 33.91,4.83 34.54,4.19 R7.2
N$37
  Bottom 0.61: R10.1 33.78,14.61 33.91,14.48 IC2.7
  Bottom 0.813: R10.1 33.91,15.11 36.07,15.11 36.07,14.73 35.05,13.72 34.54,13.72 34.42,13.59 34.42,14.48 35.18,14.48
N$38
  Bottom 0.61: IC3.3 45.47,4.45 44.45,4.45
N$39
  Bottom 0.61: IC3.1 48.01,8.51 43.69,8.51 42.42,8.26 R14.2
N$41
  Bottom 0.61: R15.1 40.13,10.67 40.13,6.48 R14.1 C3.1
N$42
  Bottom 0.61: R16.2 43.43,12.45 | 43.43,12.45 IC3.5 | R15.2 43.43,12.45
N$43
  Bottom 0.61: IC3.6 45.47,9.65 R17.1 49.78,4.57 R18.2
N$44
  Bottom 0.61: IC3.2 46.74,4.83 47.37,4.19 R13.2
N$46
  Bottom 0.61: R16.1 46.61,14.61 46.74,14.48 IC3.7
  Bottom 0.813: R16.1 46.74,15.11 48.9,15.11 48.9,14.73 47.88,13.72 47.37,13.72 47.24,13.59 47.24,14.48 48.01,14.48
N$54  (via drill 0.6)
  other vias: 37.08,13.08
N$55  (via drill 0.6)
  other vias: 35.05,14.61
N$56  (via drill 0.6)
  other vias: 32.13,3.43
N$57  (via drill 0.6)
  other vias: 30.61,1.27
N$58
  Bottom 0.61: 31.37,4.45 31.37,2.92 32.77,2.92 32.77,4.45
N$59
  Bottom 0.813: 32,4.19 32.13,4.19 32.13,3.17
N$71  (via drill 0.6)
  other vias: 49.91,13.08
N$72  (via drill 0.6)
  other vias: 47.88,14.61
N$73  (via drill 0.6)
  other vias: 44.96,3.43
N$74  (via drill 0.6)
  other vias: 43.43,1.27
N$76
  Bottom 0.61: 44.2,4.45 44.2,2.92 45.59,2.92 45.59,4.45
N$77
  Bottom 0.813: 44.83,4.19 44.96,4.19 44.96,3.17
N$78
  Bottom 0.61: IC4.3 6.99,20.57 5.97,20.57
N$79
  Bottom 0.61: IC4.1 9.53,24.64 5.21,24.64 3.94,24.38 R20.2
N$80
  Bottom 0.61: R21.1 1.65,26.8 1.65,22.61 R20.1 C4.1
N$81
  Bottom 0.61: R22.2 4.95,28.57 | 4.95,28.57 IC4.5 | R21.2 4.95,28.57
N$82
  Bottom 0.61: IC4.6 6.99,25.78 R23.1 11.3,20.7 R24.2
N$83
  Bottom 0.61: IC4.2 8.26,20.95 8.89,20.32 R19.2
N$85
  Bottom 0.61: R22.1 8.13,30.73 8.26,30.61 IC4.7
  Bottom 0.813: R22.1 8.26,31.24 10.41,31.24 10.41,30.86 9.4,29.84 8.89,29.84 8.76,29.72 8.76,30.61 9.53,30.61
N$86
  Bottom 0.61: IC5.3 19.81,20.57 18.8,20.57
N$87
  Bottom 0.61: IC5.1 22.35,24.64 18.03,24.64 16.76,24.38 R26.2
N$88
  Bottom 0.61: R27.1 14.48,26.8 14.48,22.61 R26.1 C5.1
N$89
  Bottom 0.61: R28.2 17.78,28.57 | 17.78,28.57 IC5.5 | R27.2 17.78,28.57
N$90
  Bottom 0.61: IC5.6 19.81,25.78 R29.1 24.13,20.7 R30.2
N$91
  Bottom 0.61: IC5.2 21.08,20.95 21.72,20.32 R25.2
N$92
  Bottom 0.61: IC10.1 9.53,8.51 5.21,8.51 3.94,8.26 R42.2
N$94
  Bottom 0.61: R28.1 20.95,30.73 21.08,30.61 IC5.7
  Bottom 0.813: R28.1 21.08,31.24 23.24,31.24 23.24,30.86 22.23,29.84 21.72,29.84 21.59,29.72 21.59,30.61 22.35,30.61
N$95
  Bottom 0.61: IC6.3 32.64,20.57 31.62,20.57
N$96
  Bottom 0.61: R43.1 1.65,10.67 1.65,6.48 R42.1 C11.1
N$97
  Bottom 0.61: R44.2 4.95,12.45 | 4.95,12.45 IC10.5 | R43.2 4.95,12.45
N$99
  Bottom 0.61: IC6.1 35.18,24.64 30.86,24.64 29.59,24.38 R32.2
N$100
  Bottom 0.61: R33.1 27.3,26.8 27.3,22.61 R32.1 C6.1
N$101
  Bottom 0.61: IC10.6 6.99,9.65 R45.1 11.3,4.57 R46.2
N$102
  Bottom 0.61: IC10.2 8.26,4.83 8.89,4.19 R41.2
N$103
  Bottom 0.61: R34.2 30.61,28.57 | 30.61,28.57 IC6.5 | R33.2 30.61,28.57
N$104
  Bottom 0.61: IC6.6 32.64,25.78 R35.1 36.96,20.7 R36.2
N$105
  Bottom 0.61: IC6.2 33.91,20.95 34.54,20.32 R31.2
N$107
  Bottom 0.61: R34.1 33.78,30.73 33.91,30.61 IC6.7
  Bottom 0.813: R34.1 33.91,31.24 36.07,31.24 36.07,30.86 35.05,29.84 34.54,29.84 34.42,29.72 34.42,30.61 35.18,30.61
N$108
  Bottom 0.61: IC7.3 45.47,20.57 44.45,20.57
N$109
  Bottom 0.61: IC7.1 48.01,24.64 43.69,24.64 42.42,24.38 R38.2
N$110
  Bottom 0.61: R39.1 40.13,26.8 40.13,22.61 R38.1 C7.1
N$111
  Bottom 0.61: R40.2 43.43,28.57 | 43.43,28.57 IC7.5 | R39.2 43.43,28.57
N$112
  Bottom 0.61: IC7.6 45.47,25.78 R47.1 49.78,20.7 R48.2
N$113
  Bottom 0.61: IC7.2 46.74,20.95 47.37,20.32 R37.2
N$115
  Bottom 0.61: R40.1 46.61,30.73 46.74,30.61 IC7.7
  Bottom 0.813: R40.1 46.74,31.24 48.9,31.24 48.9,30.86 47.88,29.84 47.37,29.84 47.24,29.72 47.24,30.61 48.01,30.61
N$123  (via drill 0.6)
  other vias: 11.43,29.21
N$124  (via drill 0.6)
  other vias: 9.4,30.73
N$125  (via drill 0.6)
  other vias: 6.48,19.56
N$126  (via drill 0.6)
  other vias: 4.95,17.4
N$127
  Bottom 0.61: 5.71,20.57 5.71,19.05 7.11,19.05 7.11,20.57
N$128
  Bottom 0.813: 6.35,20.32 6.48,20.32 6.48,19.3
N$136  (via drill 0.6)
  other vias: 24.26,29.21
N$137  (via drill 0.6)
  other vias: 22.23,30.73
N$138  (via drill 0.6)
  other vias: 19.3,19.56
N$139  (via drill 0.6)
  other vias: 17.78,17.4
N$140
  Bottom 0.61: 18.54,20.57 18.54,19.05 19.94,19.05 19.94,20.57
N$141
  Bottom 0.813: 19.18,20.32 19.3,20.32 19.3,19.3
N$149  (via drill 0.6)
  other vias: 37.08,29.21
N$150  (via drill 0.6)
  other vias: 35.05,30.73
N$151  (via drill 0.6)
  other vias: 32.13,19.56
N$152  (via drill 0.6)
  other vias: 30.61,17.4
N$153
  Bottom 0.61: 31.37,20.57 31.37,19.05 32.77,19.05 32.77,20.57
N$154
  Bottom 0.813: 32,20.32 32.13,20.32 32.13,19.3
N$162  (via drill 0.6)
  other vias: 49.91,29.21
N$163  (via drill 0.6)
  other vias: 47.88,30.73
N$164  (via drill 0.6)
  other vias: 44.96,19.56
N$165  (via drill 0.6)
  other vias: 43.43,17.4
N$166
  Bottom 0.61: 44.2,20.57 44.2,19.05 45.59,19.05 45.59,20.57
N$167
  Bottom 0.813: 44.83,20.32 44.96,20.32 44.96,19.3
N$168
  Bottom 0.61: IC8.3 6.99,36.7 5.97,36.7
N$169
  Bottom 0.61: IC8.1 9.53,40.77 5.21,40.77 3.94,40.51 R50.2
N$170
  Bottom 0.61: R51.1 1.65,42.93 1.65,38.73 R50.1 C8.1
N$171
  Bottom 0.61: R52.2 4.95,44.7 | 4.95,44.7 IC8.5 | R51.2 4.95,44.7
N$172
  Bottom 0.61: IC8.6 6.99,41.91 R53.1 11.3,36.83 R54.2
N$173
  Bottom 0.61: IC8.2 8.26,37.08 8.89,36.45 R49.2
N$174
  Bottom 0.61: R44.1 8.13,14.61 8.26,14.48 IC10.7
  Bottom 0.813: R44.1 8.26,15.11 10.41,15.11 10.41,14.73 9.4,13.72 8.89,13.72 8.76,13.59 8.76,14.48 9.53,14.48
N$176
  Bottom 0.61: R52.1 8.13,46.86 8.26,46.74 IC8.7
  Bottom 0.813: R52.1 8.26,47.37 10.41,47.37 10.41,46.99 9.4,45.97 8.89,45.97 8.76,45.85 8.76,46.74 9.53,46.74
N$177
  Bottom 0.61: IC9.3 19.81,36.7 18.8,36.7
N$178
  Bottom 0.61: IC9.1 22.35,40.77 18.03,40.77 16.76,40.51 R56.2
N$179
  Bottom 0.61: R57.1 14.48,42.93 14.48,38.73 R56.1 C9.1
N$180
  Bottom 0.61: R58.2 17.78,44.7 | 17.78,44.7 IC9.5 | R57.2 17.78,44.7
N$181
  Bottom 0.61: IC9.6 19.81,41.91 R59.1 24.13,36.83 R60.2
N$182
  Bottom 0.61: IC9.2 21.08,37.08 21.72,36.45 R55.2
N$184
  Bottom 0.61: R58.1 20.95,46.86 21.08,46.74 IC9.7
  Bottom 0.813: R58.1 21.08,47.37 23.24,47.37 23.24,46.99 22.23,45.97 21.72,45.97 21.59,45.85 21.59,46.74 22.35,46.74
N$185
  Bottom 0.61: IC11.3 32.64,36.7 31.62,36.7
N$186
  Bottom 0.61: IC11.1 35.18,40.77 30.86,40.77 29.59,40.51 R62.2
N$187
  Bottom 0.61: R63.1 27.3,42.93 27.3,38.73 R62.1 C10.1
N$188
  Bottom 0.61: R64.2 30.61,44.7 | 30.61,44.7 IC11.5 | R63.2 30.61,44.7
N$189
  Bottom 0.61: IC11.6 32.64,41.91 R65.1 36.96,36.83 R66.2
N$190
  Bottom 0.61: IC11.2 33.91,37.08 34.54,36.45 R61.2
N$192
  Bottom 0.61: R64.1 33.78,46.86 33.91,46.74 IC11.7
  Bottom 0.813: R64.1 33.91,47.37 36.07,47.37 36.07,46.99 35.05,45.97 34.54,45.97 34.42,45.85 34.42,46.74 35.18,46.74
N$193
  Bottom 0.61: IC12.3 45.47,36.7 44.45,36.7
N$194
  Bottom 0.61: IC12.1 48.01,40.77 43.69,40.77 42.42,40.51 R68.2
N$195
  Bottom 0.61: R69.1 40.13,42.93 40.13,38.73 R68.1 C12.1
N$196
  Bottom 0.61: R70.2 43.43,44.7 | 43.43,44.7 IC12.5 | R69.2 43.43,44.7
N$197
  Bottom 0.61: IC12.6 45.47,41.91 R71.1 49.78,36.83 R72.2
N$198
  Bottom 0.61: IC12.2 46.74,37.08 47.37,36.45 R67.2
N$200
  Bottom 0.61: R70.1 46.61,46.86 46.74,46.74 IC12.7
  Bottom 0.813: R70.1 46.74,47.37 48.9,47.37 48.9,46.99 47.88,45.97 47.37,45.97 47.24,45.85 47.24,46.74 48.01,46.74
N$201
  Bottom 0.61: IC13.3 6.99,52.83 5.97,52.83
N$202
  Bottom 0.61: IC13.1 9.53,56.9 5.21,56.9 3.94,56.64 R74.2
N$203
  Bottom 0.61: R75.1 1.65,59.05 1.65,54.86 R74.1 C13.1
N$204
  Bottom 0.61: R76.2 4.95,60.83 | 4.95,60.83 IC13.5 | R75.2 4.95,60.83
N$205
  Bottom 0.61: IC13.6 6.99,58.04 R77.1 11.3,52.96 R78.2
N$206
  Bottom 0.61: IC13.2 8.26,53.21 8.89,52.58 R73.2
N$208
  Bottom 0.61: R76.1 8.13,62.99 8.26,62.87 IC13.7
  Bottom 0.813: R76.1 8.26,63.5 10.41,63.5 10.41,63.12 9.4,62.1 8.89,62.1 8.76,61.98 8.76,62.87 9.53,62.87
N$209
  Bottom 0.61: IC14.3 19.81,52.83 18.8,52.83
N$210
  Bottom 0.61: IC14.1 22.35,56.9 18.03,56.9 16.76,56.64 R80.2
N$211
  Bottom 0.61: R81.1 14.48,59.05 14.48,54.86 R80.1 C14.1
N$212
  Bottom 0.61: R82.2 17.78,60.83 | 17.78,60.83 IC14.5 | R81.2 17.78,60.83
N$213
  Bottom 0.61: IC14.6 19.81,58.04 R83.1 24.13,52.96 R84.2
N$214
  Bottom 0.61: IC14.2 21.08,53.21 21.72,52.58 R79.2
N$216
  Bottom 0.61: R82.1 20.95,62.99 21.08,62.87 IC14.7
  Bottom 0.813: R82.1 21.08,63.5 23.24,63.5 23.24,63.12 22.23,62.1 21.72,62.1 21.59,61.98 21.59,62.87 22.35,62.87
N$217
  Bottom 0.61: IC15.3 32.64,52.83 31.62,52.83
N$218
  Bottom 0.61: IC15.1 35.18,56.9 30.86,56.9 29.59,56.64 R86.2
N$219
  Bottom 0.61: R87.1 27.3,59.05 27.3,54.86 R86.1 C15.1
N$220
  Bottom 0.61: R88.2 30.61,60.83 | 30.61,60.83 IC15.5 | R87.2 30.61,60.83
N$221
  Bottom 0.61: IC15.6 32.64,58.04 R89.1 36.96,52.96 R90.2
N$222
  Bottom 0.61: IC15.2 33.91,53.21 34.54,52.58 R85.2
N$224
  Bottom 0.61: R88.1 33.78,62.99 33.91,62.87 IC15.7
  Bottom 0.813: R88.1 33.91,63.5 36.07,63.5 36.07,63.12 35.05,62.1 34.54,62.1 34.42,61.98 34.42,62.87 35.18,62.87
N$225
  Bottom 0.61: IC16.3 45.47,52.83 44.45,52.83
N$226
  Bottom 0.61: IC16.1 48.01,56.9 43.69,56.9 42.42,56.64 R92.2
N$227
  Bottom 0.61: R93.1 40.13,59.05 40.13,54.86 R92.1 C16.1
N$228
  Bottom 0.61: R94.2 43.43,60.83 | 43.43,60.83 IC16.5 | R93.2 43.43,60.83
N$229
  Bottom 0.61: IC16.6 45.47,58.04 R95.1 49.78,52.96 R96.2
N$230
  Bottom 0.61: IC16.2 46.74,53.21 47.37,52.58 R91.2
N$232
  Bottom 0.61: R94.1 46.61,62.99 46.74,62.87 IC16.7
  Bottom 0.813: R94.1 46.74,63.5 48.9,63.5 48.9,63.12 47.88,62.1 47.37,62.1 47.24,61.98 47.24,62.87 48.01,62.87
N$240  (via drill 0.6)
  other vias: 11.43,45.34
N$241  (via drill 0.6)
  other vias: 9.4,46.86
N$242  (via drill 0.6)
  other vias: 6.48,35.69
N$243  (via drill 0.6)
  other vias: 4.95,33.53
N$244
  Bottom 0.61: 5.71,36.7 5.71,35.18 7.11,35.18 7.11,36.7
N$245
  Bottom 0.813: 6.35,36.45 6.48,36.45 6.48,35.43
N$253  (via drill 0.6)
  other vias: 24.26,45.34
N$254  (via drill 0.6)
  other vias: 22.23,46.86
N$255  (via drill 0.6)
  other vias: 19.3,35.69
N$256  (via drill 0.6)
  other vias: 17.78,33.53
N$257
  Bottom 0.61: 18.54,36.7 18.54,35.18 19.94,35.18 19.94,36.7
N$258
  Bottom 0.813: 19.18,36.45 19.3,36.45 19.3,35.43
N$266  (via drill 0.6)
  other vias: 37.08,45.34
N$267  (via drill 0.6)
  other vias: 35.05,46.86
N$268  (via drill 0.6)
  other vias: 32.13,35.69
N$269  (via drill 0.6)
  other vias: 30.61,33.53
N$270
  Bottom 0.61: 31.37,36.7 31.37,35.18 32.77,35.18 32.77,36.7
N$271
  Bottom 0.813: 32,36.45 32.13,36.45 32.13,35.43
N$279  (via drill 0.6)
  other vias: 49.91,45.34
N$280  (via drill 0.6)
  other vias: 47.88,46.86
N$281  (via drill 0.6)
  other vias: 44.96,35.69
N$282  (via drill 0.6)
  other vias: 43.43,33.53
N$283
  Bottom 0.61: 44.2,36.7 44.2,35.18 45.59,35.18 45.59,36.7
N$284
  Bottom 0.813: 44.83,36.45 44.96,36.45 44.96,35.43
N$292  (via drill 0.6)
  other vias: 11.43,61.47
N$293  (via drill 0.6)
  other vias: 9.4,62.99
N$294  (via drill 0.6)
  other vias: 6.48,51.82
N$295  (via drill 0.6)
  other vias: 4.95,49.66
N$296
  Bottom 0.61: 5.71,52.83 5.71,51.31 7.11,51.31 7.11,52.83
N$297
  Bottom 0.813: 6.35,52.58 6.48,52.58 6.48,51.56
N$305  (via drill 0.6)
  other vias: 24.26,61.47
N$306  (via drill 0.6)
  other vias: 22.23,62.99
N$307  (via drill 0.6)
  other vias: 19.3,51.82
N$308  (via drill 0.6)
  other vias: 17.78,49.66
N$309
  Bottom 0.61: 18.54,52.83 18.54,51.31 19.94,51.31 19.94,52.83
N$310
  Bottom 0.813: 19.18,52.58 19.3,52.58 19.3,51.56
N$318  (via drill 0.6)
  other vias: 37.08,61.47
N$319  (via drill 0.6)
  other vias: 35.05,62.99
N$320  (via drill 0.6)
  other vias: 32.13,51.82
N$321  (via drill 0.6)
  other vias: 30.61,49.66
N$322
  Bottom 0.61: 31.37,52.83 31.37,51.31 32.77,51.31 32.77,52.83
N$323
  Bottom 0.813: 32,52.58 32.13,52.58 32.13,51.56
N$331  (via drill 0.6)
  other vias: 49.91,61.47
N$332  (via drill 0.6)
  other vias: 47.88,62.99
N$333  (via drill 0.6)
  other vias: 44.96,51.82
N$334  (via drill 0.6)
  other vias: 43.43,49.66
N$335
  Bottom 0.61: 44.2,52.83 44.2,51.31 45.59,51.31 45.59,52.83
N$336
  Bottom 0.813: 44.83,52.58 44.96,52.58 44.96,51.56
VCC  (15 unrouted)
  Bottom 0.61: 11.12,11.62 R45.2 | 9.65,11.94 10.67,11.94 | 23.94,11.62 R5.2 | 22.48,11.94 23.5,11.94 | 36.77,11.62 R11.2 | 35.31,11.94 36.32,11.94 | 49.6,11.62 R17.2 | 48.13,11.94 49.15,11.94 | 11.12,27.75 R23.2 | 9.65,28.07 10.67,28.07 | 23.94,27.75 R29.2 | 22.48,28.07 23.5,28.07 | 36.77,27.75 R35.2 | 35.31,28.07 36.32,28.07 | 49.6,27.75 R47.2 | 48.13,28.07 49.15,28.07 | 11.12,43.88 R53.2 | 9.65,44.2 10.67,44.2 | 23.94,43.88 R59.2 | 22.48,44.2 23.5,44.2 | 36.77,43.88 R65.2 | 35.31,44.2 36.32,44.2 | 49.6,43.88 R71.2 | 48.13,44.2 49.15,44.2 | 11.12,60 R77.2 | 9.65,60.33 10.67,60.33 | 23.94,60 R83.2 | 22.48,60.33 23.5,60.33 | 36.77,60 R89.2 | 35.31,60.33 36.32,60.33 | 49.6,60 R95.2 | 48.13,60.33 49.15,60.33
  Bottom 0.813: R45.2 11.94,11.43 11.94,13.97 11.43,13.97 10.67,13.21 10.67,11.94 11.3,11.94 11.3,13.21 | R5.2 24.77,11.43 24.77,13.97 24.26,13.97 23.5,13.21 23.5,11.94 24.13,11.94 24.13,13.21 | R11.2 37.59,11.43 37.59,13.97 37.08,13.97 36.32,13.21 36.32,11.94 36.96,11.94 36.96,13.21 | R17.2 50.42,11.43 50.42,13.97 49.91,13.97 49.15,13.21 49.15,11.94 49.78,11.94 49.78,13.21 | R23.2 11.94,27.56 11.94,30.1 11.43,30.1 10.67,29.34 10.67,28.07 11.3,28.07 11.3,29.34 | R29.2 24.77,27.56 24.77,30.1 24.26,30.1 23.5,29.34 23.5,28.07 24.13,28.07 24.13,29.34 | R35.2 37.59,27.56 37.59,30.1 37.08,30.1 36.32,29.34 36.32,28.07 36.96,28.07 36.96,29.34 | R47.2 50.42,27.56 50.42,30.1 49.91,30.1 49.15,29.34 49.15,28.07 49.78,28.07 49.78,29.34 | R53.2 11.94,43.69 11.94,46.23 11.43,46.23 10.67,45.47 10.67,44.2 11.3,44.2 11.3,45.47 | R59.2 24.77,43.69 24.77,46.23 24.26,46.23 23.5,45.47 23.5,44.2 24.13,44.2 24.13,45.47 | R65.2 37.59,43.69 37.59,46.23 37.08,46.23 36.32,45.47 36.32,44.2 36.96,44.2 36.96,45.47 | R71.2 50.42,43.69 50.42,46.23 49.91,46.23 49.15,45.47 49.15,44.2 49.78,44.2 49.78,45.47 | R77.2 11.94,59.82 11.94,62.36 11.43,62.36 10.67,61.59 10.67,60.33 11.3,60.33 11.3,61.59 | R83.2 24.77,59.82 24.77,62.36 24.26,62.36 23.5,61.59 23.5,60.33 24.13,60.33 24.13,61.59 | R89.2 37.59,59.82 37.59,62.36 37.08,62.36 36.32,61.59 36.32,60.33 36.96,60.33 36.96,61.59 | R95.2 50.42,59.82 50.42,62.36 49.91,62.36 49.15,61.59 49.15,60.33 49.78,60.33 49.78,61.59
(copper drawn outside any net)
  shapes: Bottom circle x16